# EAGLE design open-race-scale-pi-zero-board-v.04 (EAGLE 8.2.2)
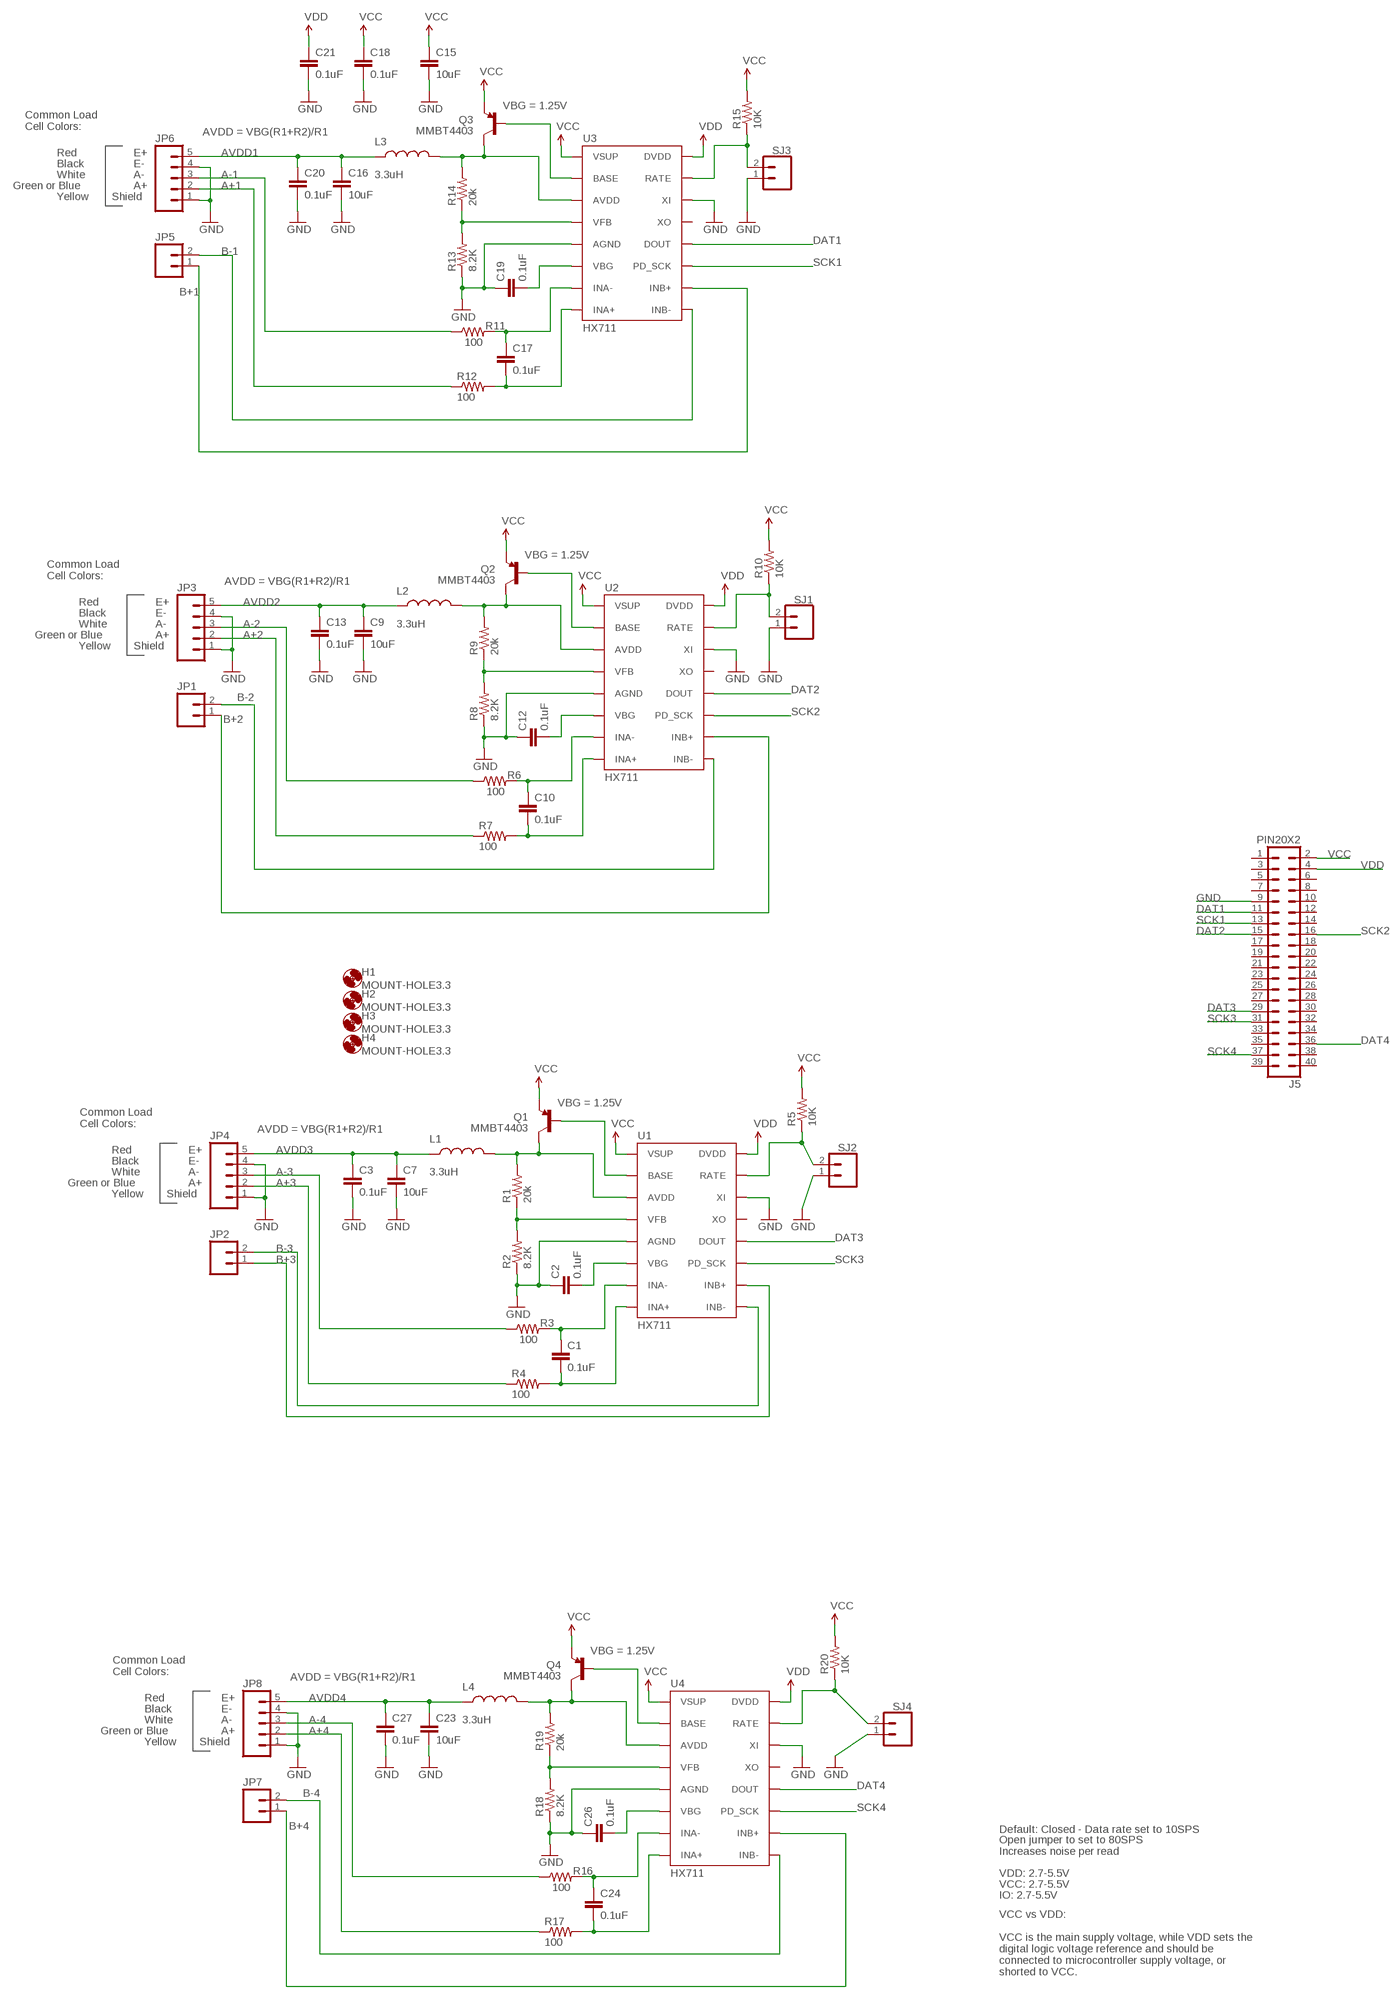
[diagram p0: schematic, sheet 1]

## Parts
C1  0.1uF  0.1UF-25V-5%(0603)  [0603-CAP]
C2  0.1uF  0.1UF-25V-5%(0603)  [0603-CAP]
C3  0.1uF  0.1UF-25V-5%(0603)  [0603-CAP]
C7  10uF  10UF50V20%(1210)  [1210]
C9  10uF  10UF50V20%(1210)  [1210]
C10  0.1uF  0.1UF-25V-5%(0603)  [0603-CAP]
C12  0.1uF  0.1UF-25V-5%(0603)  [0603-CAP]
C13  0.1uF  0.1UF-25V-5%(0603)  [0603-CAP]
C15  10uF  10UF50V20%(1210)  [1210]
C16  10uF  10UF50V20%(1210)  [1210]
C17  0.1uF  0.1UF-25V-5%(0603)  [0603-CAP]
C18  0.1uF  0.1UF-25V-5%(0603)  [0603-CAP]
C19  0.1uF  0.1UF-25V-5%(0603)  [0603-CAP]
C20  0.1uF  0.1UF-25V-5%(0603)  [0603-CAP]
C21  0.1uF  0.1UF-25V-5%(0603)  [0603-CAP]
C23  10uF  10UF50V20%(1210)  [1210]
C24  0.1uF  0.1UF-25V-5%(0603)  [0603-CAP]
C26  0.1uF  0.1UF-25V-5%(0603)  [0603-CAP]
C27  0.1uF  0.1UF-25V-5%(0603)  [0603-CAP]
H1  MOUNT-HOLE3.3  [3,3]
H2  MOUNT-HOLE3.3  [3,3]
H3  MOUNT-HOLE3.3  [3,3]
H4  MOUNT-HOLE3.3  [3,3]
J5  PIN20X2  [PIN_20X2]
JP1  M02PTH  [1X02@1]
JP2  M02PTH  [1X02@1]
JP3  M05PTH  [1X05]
JP4  M05PTH  [1X05]
JP5  M02PTH  [1X02@1]
JP6  M05PTH  [1X05]
JP7  M02PTH  [1X02@1]
JP8  M05PTH  [1X05]
L1  3.3uH  INDUCTOR0805-IND  [0805]
L2  3.3uH  INDUCTOR0805-IND  [0805]
L3  3.3uH  INDUCTOR0805-IND  [0805]
L4  3.3uH  INDUCTOR0805-IND  [0805]
Q1  MMBT4403  TRANSISTOR_PNPMMBT4403  [SOT23-3]
Q2  MMBT4403  TRANSISTOR_PNPMMBT4403  [SOT23-3]
Q3  MMBT4403  TRANSISTOR_PNPMMBT4403  [SOT23-3]
Q4  MMBT4403  TRANSISTOR_PNPMMBT4403  [SOT23-3]
R1  20k  20KOHM1/10W1%(0603)  [0603-RES]
R2  8.2K  8.2KOHM-1/10W-5%(0603)  [0603-RES]
R3  100  100OHM-1/10W-1%(0603)  [0603-RES]
R4  100  100OHM-1/10W-1%(0603)  [0603-RES]
R5  10K  10KOHM-1/10W-1%(0603)0603  [0603-RES]
R6  100  100OHM-1/10W-1%(0603)  [0603-RES]
R7  100  100OHM-1/10W-1%(0603)  [0603-RES]
R8  8.2K  8.2KOHM-1/10W-5%(0603)  [0603-RES]
R9  20k  20KOHM1/10W1%(0603)  [0603-RES]
R10  10K  10KOHM-1/10W-1%(0603)0603  [0603-RES]
R11  100  100OHM-1/10W-1%(0603)  [0603-RES]
R12  100  100OHM-1/10W-1%(0603)  [0603-RES]
R13  8.2K  8.2KOHM-1/10W-5%(0603)  [0603-RES]
R14  20k  20KOHM1/10W1%(0603)  [0603-RES]
R15  10K  10KOHM-1/10W-1%(0603)0603  [0603-RES]
R16  100  100OHM-1/10W-1%(0603)  [0603-RES]
R17  100  100OHM-1/10W-1%(0603)  [0603-RES]
R18  8.2K  8.2KOHM-1/10W-5%(0603)  [0603-RES]
R19  20k  20KOHM1/10W1%(0603)  [0603-RES]
R20  10K  10KOHM-1/10W-1%(0603)0603  [0603-RES]
SJ1  CONN_02  [1X02]
SJ2  CONN_02  [1X02]
SJ3  CONN_02  [1X02]
SJ4  CONN_02  [1X02]
U1  HX711  HX711HX711  [SO16]
U2  HX711  HX711HX711  [SO16]
U3  HX711  HX711HX711  [SO16]
U4  HX711  HX711HX711  [SO16]

## Nets
A+1: JP6.2 R12.1
A+2: JP3.2 R7.1
A+3: JP4.2 R4.1
A+4: JP8.2 R17.1
A-1: JP6.3 R11.1
A-2: JP3.3 R6.1
A-3: JP4.3 R3.1
A-4: JP8.3 R16.1
AVDD1: C16.1 C20.1 JP6.5 L3.1
AVDD2: C9.1 C13.1 JP3.5 L2.1
AVDD3: C3.1 C7.1 JP4.5 L1.1
AVDD4: C23.1 C27.1 JP8.5 L4.1
B+1: JP5.1 U3.10(INB+)
B+2: JP1.1 U2.10(INB+)
B+3: JP2.1 U1.10(INB+)
B+4: JP7.1 U4.10(INB+)
B-1: JP5.2 U3.9(INB-)
B-2: JP1.2 U2.9(INB-)
B-3: JP2.2 U1.9(INB-)
B-4: JP7.2 U4.9(INB-)
DAT1: J5.11 U3.12(DOUT)
DAT2: J5.15 U2.12(DOUT)
DAT3: J5.29 U1.12(DOUT)
DAT4: J5.36 U4.12(DOUT)
GND: C2.1 C3.2 C7.2 C9.2 C12.1 C13.2 C15.2 C16.2 C18.2 C19.1 C20.2 C21.2 C23.2 C26.1 C27.2 J5.9 JP3.1 JP3.4 JP4.1 JP4.4 JP6.1 JP6.4 JP8.1 JP8.4 R2.1 R8.1 R13.1 R18.1 SJ1.1 SJ2.1 SJ3.1 SJ4.1 U1.5(AGND) U1.14(XI) U2.5(AGND) U2.14(XI) U3.5(AGND) U3.14(XI) U4.5(AGND) U4.14(XI)
N$1: R5.1 SJ2.2 U1.15(RATE)
N$2: C1.1 R3.2 U1.7(INA-)
N$3: C1.2 R4.2 U1.8(INA+)
N$4: Q1.1(B) U1.2(BASE)
N$5: L1.2 Q1.3(C) R1.2 U1.3(AVDD)
N$6: R1.1 R2.2 U1.4(VFB)
N$7: C2.2 U1.6(VBG)
N$9: R8.2 R9.1 U2.4(VFB)
N$10: C12.2 U2.6(VBG)
N$20: C17.1 R11.2 U3.7(INA-)
N$21: C17.2 R12.2 U3.8(INA+)
N$22: Q4.1(B) U4.2(BASE)
N$23: R18.2 R19.1 U4.4(VFB)
N$24: C26.2 U4.6(VBG)
N$25: L4.2 Q4.3(C) R19.2 U4.3(AVDD)
N$26: R20.1 SJ4.2 U4.15(RATE)
N$27: C24.1 R16.2 U4.7(INA-)
N$28: C24.2 R17.2 U4.8(INA+)
N$82: Q2.1(B) U2.2(BASE)
N$112: L2.2 Q2.3(C) R9.2 U2.3(AVDD)
N$122: R10.1 SJ1.2 U2.15(RATE)
N$132: C10.1 R6.2 U2.7(INA-)
N$142: C10.2 R7.2 U2.8(INA+)
N$151: Q3.1(B) U3.2(BASE)
N$161: R13.2 R14.1 U3.4(VFB)
N$171: C19.2 U3.6(VBG)
N$182: L3.2 Q3.3(C) R14.2 U3.3(AVDD)
N$191: R15.1 SJ3.2 U3.15(RATE)
SCK1: J5.13 U3.11(PD_SCK)
SCK2: J5.16 U2.11(PD_SCK)
SCK3: J5.31 U1.11(PD_SCK)
SCK4: J5.37 U4.11(PD_SCK)
VCC: C15.1 C18.1 J5.2 Q1.2(E) Q2.2(E) Q3.2(E) Q4.2(E) R5.2 R10.2 R15.2 R20.2 U1.1(VSUP) U2.1(VSUP) U3.1(VSUP) U4.1(VSUP)
VDD: C21.1 J5.4 U1.16(DVDD) U2.16(DVDD) U3.16(DVDD) U4.16(DVDD)
Unconnected: J5.1 J5.3 J5.5 J5.6 J5.7 J5.8 J5.10 J5.12 J5.14 J5.17 J5.18 J5.19 J5.20 J5.21 J5.22 J5.23 J5.24 J5.25 J5.26 J5.27 J5.28 J5.30 J5.32 J5.33 J5.34 J5.35 J5.38 J5.39 J5.40 U1.13(XO) U2.13(XO) U3.13(XO) U4.13(XO)

## Notes on the sheet
- VBG = 1.25V
- Common Load
  Cell Colors:
- AVDD = VBG(R1+R2)/R1
- Red | E+
- Black | E-
- White | A-
- Green or Blue | A+
- Yellow | Shield
- VBG = 1.25V
- Common Load
  Cell Colors:
- AVDD = VBG(R1+R2)/R1
- Red | E+
- Black | E-
- White | A-
- Green or Blue | A+
- Yellow | Shield
- VBG = 1.25V
- Common Load
  Cell Colors:
- AVDD = VBG(R1+R2)/R1
- Red | E+
- Black | E-
- White | A-
- Green or Blue | A+
- Yellow | Shield
- VBG = 1.25V
- Common Load
  Cell Colors:
- AVDD = VBG(R1+R2)/R1
- Red | E+
- Black | E-
- White | A-
- Green or Blue | A+
- Yellow | Shield
- Default: Closed - Data rate set to 10SPS
- Open jumper to set to 80SPS
  Increases noise per read
- VDD: 2.7-5.5V
- VCC: 2.7-5.5V
- IO: 2.7-5.5V
- VCC vs VDD:
  
  VCC is the main supply voltage, while VDD sets the
  digital logic voltage reference and should be
  connected to microcontroller supply voltage, or
  shorted to VCC.

## Library data of the parts
C1-C3 C10 C12 C13 C17-C21 C24 C26 C27 = SparkFun-Capacitors:0.1UF-25V-5%(0603): CAP-08604; PROD_ID: CAP-08604
C7 C9 C15 C16 C23 = SparkFun-Capacitors:10UF50V20%(1210): CAP-09824; PROD_ID: CAP-09824
H1-H4 = holes:MOUNT-HOLE: MOUNTING HOLE with drill center marker
J5 = FLYFISH:PIN20X2
JP1 JP2 JP5 JP7 = SparkFun-Connectors:M02: Standard 2-pin 0.1" header. Use with - straight break away headers ( PRT-00116) - right angle break away headers (PRT-00553) - swiss pins (PRT-00743) - machine pins (PRT-00117) - female headers (PRT-00115) Molex polarized connector foot print use with: PRT-08233 with associated crimp pins and housings. 2.54_SCREWTERM for use with PRT-10571. 3.5mm Screw Terminal footprints for PRT-08084 5mm Screw Terminal footprints for use with PRT-08432
JP3 JP4 JP6 JP8 = SparkFun-Connectors:M05: Header 5 Standard 5-pin 0.1" header. Use with straight break away headers (SKU : PRT-00116), right angle break away headers (PRT-00553), swiss pins (PRT-00743), machine pins (PRT-00117), and female headers (PRT-00115). Molex polarized connector foot print use with SKU : PRT-08230 with associated crimp pins and housings.
L1-L4 = SparkFun-Passives:INDUCTOR: Inductors Basic Inductor/Choke - 0603 and 1206. Footprints are not proven and vary greatly between part numbers. INDUCTOR POWER 3.3UH 4.0A SMD 0.197" L x 0.197" W x 0.177" H (5.00mm x 5.00mm x 4.50mm); PROD_ID: NDUC-13076
Q1-Q4 = SparkFun-DiscreteSemi:TRANSISTOR_PNP: Generic PNP BJT Double check pinouts against datasheets- not all devices are the same! MMBT3906 - 40V 200mA SOT-23 (TRANS-08052) MMBT4403 - 40V 600mA SOT-23 (TRANS-09245); PROD_ID: TRANS-09245
R1 R9 R14 R19 = SparkFun-Resistors:20KOHM1/10W1%(0603): RES-09383; PROD_ID: RES-09383
R2 R8 R13 R18 = SparkFun-Resistors:8.2KOHM-1/10W-5%(0603): RES-10646; PROD_ID: RES-10646
R3 R4 R6 R7 R11 R12 R16 R17 = SparkFun-Resistors:100OHM-1/10W-1%(0603): RES-07863; PROD_ID: RES-07863
R5 R10 R15 R20 = SparkFun-Resistors:10KOHM-1/10W-1%(0603): RES-00824; PROD_ID: RES-00824
SJ1-SJ4 = SparkFun-Connectors:CONN_02: Multi connection point. Often used as Generic Header-pin footprint for 0.1 inch spaced/style header connections On any of the 0.1 inch spaced packages, you can populate with these: Break Away Headers - Straight <https://www.sparkfun.com/products/116> (PRT-00116) Break Away Male Headers - Right Angle <https://www.sparkfun.com/products/553> (PRT-00553) Female Headers <https://www.sparkfun.com/products/115> (PRT-00115) Break Away Headers - Machine Pin <https://www.sparkfun.com/products/117> (PRT-00117) Break Away Female Headers - Swiss Machine Pin <https://www.sparkfun.com/products/743> (PRT-00743) For SCREWTERMINALS and SPRING TERMINALS visit here: Screw Terimnals on SparkFun.com <https://www.sparkfun.com/search/results?term=Screw+Terminals> (5mm/3.5mm/2.54mm spacing) This device is also useful as a general connection point to wire up your design to another part of your project. Our various solder wires solder well into these plated through hole pads. Hook-Up Wire - Assortment (Stranded, 22 AWG) <https://www.sparkfun.com/products/11375> (PRT-11375) Hook-Up Wire - Assortment (Solid Core, 22 AWG) <https://www.sparkfun.com/products/11367> (PRT-11367) View the entire wire category on our website here <https://www.sparkfun.com/categories/141> Special notes: Molex polarized connector foot print use with: PRT-08233 with associated crimp pins and housings. 2.54_SCREWTERM for use with PRT-10571. 3.5mm Screw Terminal footprints for PRT-08084 5mm Screw Terminal footprints for use with PRT-08432
U1-U4 = Testing:HX711; PROD_ID: IC-12445

## Board
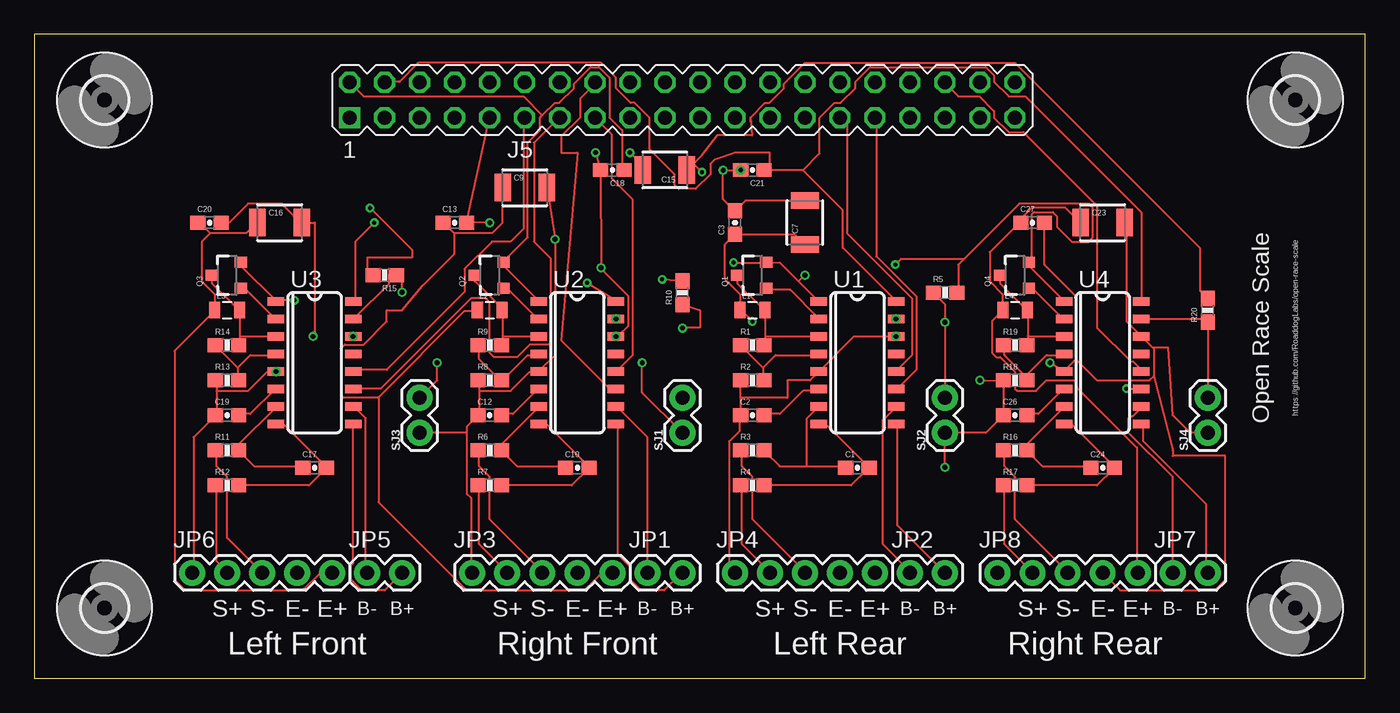
[diagram p1: board, top side]
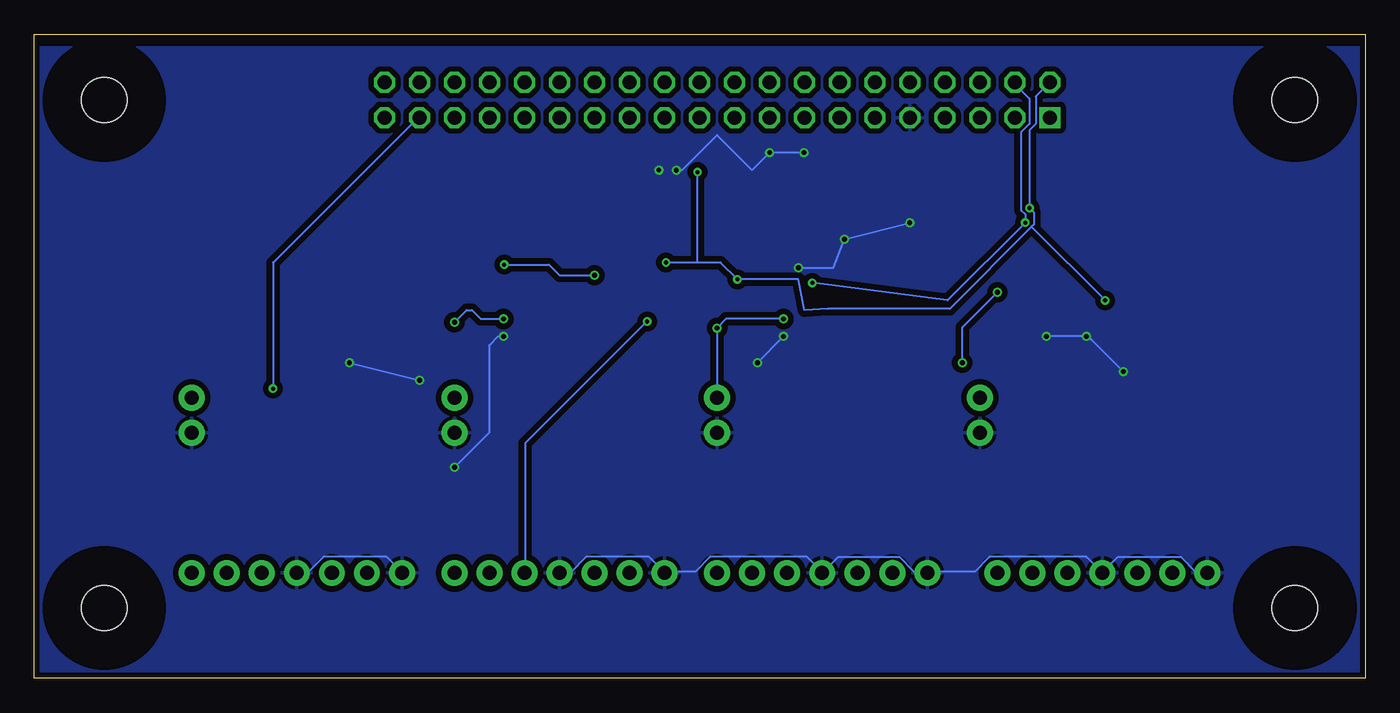
[diagram p2: board, bottom side, seen from below]

Size 96.5 x 46.66 mm. Coordinates in mm from the lower left corner, seen from the top.
Outline: 0,0 96.5,0 96.5,46.66 0,46.66 0,0
Copper layers (1*16): Top 0.035mm / dielectric 1.5mm / Bottom 0.035mm
Design rules "SeeedStudio_2layer_DRU_no_angle_20140221": minimum track width 6mil, minimum drill 12mil, track to track 6mil, track to pad 6mil, pad to pad 6mil, via to via 6mil, smd to smd 0mil, copper to edge 10mil, drill to drill 10mil, minimum pad ring 10mil, minimum via ring 6mil, stop-mask expansion 2mil, vias tented up to drill 100mil, thermal gap 10mil

### Footprints (pad centres in the part's own frame; a part is rotated, then mirrored left to right if it is on the bottom)
0603-CAP = smd 1.1 x 1: 1 -0.85,0; 2 0.85,0
1210 = smd 1.2 x 2: 1 -1.6,0; 2 1.6,0
3,3 = hole 3.3: 0,0
PIN_20X2 = drill 1.016 square: 1 -24.13,-1.27 | drill 1.016 octagon: 2 -24.13,1.27; 3 -21.59,-1.27; 4 -21.59,1.27; 5 -19.05,-1.27; 6 -19.05,1.27; 7 -16.51,-1.27; 8 -16.51,1.27; 9 -13.97,-1.27; 10 -13.97,1.27; 11 -11.43,-1.27; 12 -11.43,1.27; 13 -8.89,-1.27; 14 -8.89,1.27; 15 -6.35,-1.27; 16 -6.35,1.27; 17 -3.81,-1.27; 18 -3.81,1.27; 19 -1.27,-1.27; 20 -1.27,1.27; 21 1.27,-1.27; 22 1.27,1.27; 23 3.81,-1.27; 24 3.81,1.27; 25 6.35,-1.27; 26 6.35,1.27; 27 8.89,-1.27; 28 8.89,1.27; 29 11.43,-1.27; 30 11.43,1.27; 31 13.97,-1.27; 32 13.97,1.27; 33 16.51,-1.27; 34 16.51,1.27; 35 19.05,-1.27; 36 19.05,1.27; 37 21.59,-1.27; 38 21.59,1.27; 39 24.13,-1.27; 40 24.13,1.27
1X02@1 = drill 1.016 pad 1.88: 1 0,0; 2 2.54,0
1X05 = drill 1.016 pad 1.88: 1 0,0; 2 2.54,0; 3 5.08,0; 4 7.62,0; 5 10.16,0
0805 = smd 0.8 x 1.2: 1 -0.9,0; 2 0.9,0
SOT23-3 = smd 0.8 x 0.9: 1 -0.95,-1; 2 0.95,-1; 3 0,1.1
0603-RES = smd 1.1 x 1: 1 -0.85,0; 2 0.85,0
1X02 = drill 1.016 pad 1.88: 1 0,0; 2 2.54,0
SO16 = smd 0.6 x 1.2: 1 -4.445,-2.8; 2 -3.175,-2.8; 3 -1.905,-2.8; 4 -0.635,-2.8; 5 0.635,-2.8; 6 1.905,-2.8; 7 3.175,-2.8; 8 4.445,-2.8; 9 4.445,2.8; 10 3.175,2.8; 11 1.905,2.8; 12 0.635,2.8; 13 -0.635,2.8; 14 -1.905,2.8; 15 -3.175,2.8; 16 -4.445,2.8

### Placement (x,y rotation side)
C1  59.69,15.24 0 top
C2  52.07,19.05 0 top
C3  50.8,33.02 90 top
C7  55.88,33.02 90 top
C9  35.56,35.56 0 top
C10  39.37,15.24 0 top
C12  33.02,19.05 0 top
C13  30.48,33.02 0 top
C15  45.72,36.83 180 top
C16  17.78,33.02 0 top
C17  20.32,15.24 0 top
C18  41.91,36.83 180 top
C19  13.97,19.05 0 top
C20  12.7,33.02 0 top
C21  52.07,36.83 180 top
C23  77.47,33.02 0 top
C24  77.47,15.24 0 top
C26  71.12,19.05 0 top
C27  72.39,33.02 0 top
H1  5.08,5.08 0 top
H2  5.08,41.91 0 top
H3  91.44,41.91 0 top
H4  91.44,5.08 0 top
J5  46.99,41.91 0 top
JP1  44.45,7.62 0 top
JP2  63.5,7.62 0 top
JP3  31.75,7.62 0 top
JP4  50.8,7.62 0 top
JP5  24.13,7.62 0 top
JP6  11.43,7.62 0 top
JP7  82.55,7.62 0 top
JP8  69.85,7.62 0 top
L1  52.07,26.67 0 top
L2  33.02,26.67 0 top
L3  13.97,26.67 0 top
L4  71.12,26.67 0 top
Q1  52.07,29.21 90 top
Q2  33.02,29.21 90 top
Q3  13.97,29.21 90 top
Q4  71.12,29.21 90 top
R1  52.07,24.13 0 top
R2  52.07,21.59 0 top
R3  52.07,16.51 0 top
R4  52.07,13.97 0 top
R5  66.04,27.94 0 top
R6  33.02,16.51 0 top
R7  33.02,13.97 0 top
R8  33.02,21.59 0 top
R9  33.02,24.13 0 top
R10  46.99,27.94 90 top
R11  13.97,16.51 0 top
R12  13.97,13.97 0 top
R13  13.97,21.59 0 top
R14  13.97,24.13 0 top
R15  25.4,29.21 180 top
R16  71.12,16.51 0 top
R17  71.12,13.97 0 top
R18  71.12,21.59 0 top
R19  71.12,24.13 0 top
R20  85.09,26.67 90 top
SJ1  46.99,17.78 90 top
SJ2  66.04,17.78 90 top
SJ3  27.94,17.78 90 top
SJ4  85.09,17.78 90 top
U1  59.69,22.86 270 top
U2  39.37,22.86 270 top
U3  20.32,22.86 270 top
U4  77.47,22.86 270 top

### Tracks (layer width: path | path; a pad name or v marks a point on that pad's centre or on a via)
A+1
  Top 0.152: R12.1 13.21,13.97 13.21,8.48 13.97,7.72 JP6.2
A+2
  Top 0.152: R7.1 32.26,13.97 32.26,9.7 34.24,7.72 JP3.2
A+3
  Top 0.152: R4.1 51.31,13.97 51.31,9.7 53.29,7.72 JP4.2
A+4
  Top 0.152: R17.1 70.36,13.97 70.36,9.7 72.34,7.72 JP8.2
A-1
  Top 0.152: JP6.3 13.97,10.16 13.97,14.58 13.21,15.34 13.21,16.41 R11.1
A-2
  Top 0.152: R6.1 32.26,16.41 32.26,15.34 33.02,14.58 33.02,11.53 36.83,7.72 JP3.3
A-3
  Top 0.152: R3.1 51.31,16.41 51.31,15.34 52.07,14.58 52.07,11.53 55.88,7.72 JP4.3
A-4
  Top 0.152: R16.1 70.36,16.41 70.36,15.34 71.12,14.58 71.12,11.53 74.93,7.72 JP8.3
AVDD1
  Top 0.152: 12.75,32.26 11.99,33.02 C20.1 | 12.75,32.26 15.34,32.26 16.1,33.02 C16.1 | 12.75,32.26 12.14,31.65 12.14,28.75 13.06,27.84 13.06,26.77 L3.1 13.06,26.62 10.16,23.72 10.16,7.11 10.92,6.35 19.46,6.35 20.68,7.57 21.59,7.57 JP6.5
AVDD2
  Top 0.152: 30.43,32.26 29.67,33.02 C13.1 | 30.43,32.26 33.17,32.26 33.93,33.02 C9.1 | 24.94,20.37 31.19,26.62 32.11,26.62 L2.1 | 24.94,20.37 22.35,20.37 22.2,20.52 22.2,23.88 22.5,24.18 23.88,24.18 25.55,25.86 25.55,26.67 26.67,26.67 28.14,28.45 30.43,30.73 30.43,32.26 | 24.94,20.37 24.94,12.75 31.34,6.35 39.88,6.35 41.1,7.57 41.86,7.57 JP3.5
AVDD3  (via drill 0.3)
  Top 0.152: v52.07,25.86 51.31,26.62 L1.1 51.16,26.77 51.16,27.84 50.09,28.91 50.09,31.46 C3.1 55.13,32.17 C7.1
  Bottom 0.152: v52.07,25.86 60.91,17.02 60.91,7.72 JP4.5
AVDD4
  Top 0.152: C23.1 75.84,33.02 74.78,34.09 72.34,34.09 71.58,33.32 71.58,33.02 C27.1 71.42,33.02 69.29,30.89 69.29,28.75 70.21,27.84 70.21,26.77 L4.1 70.21,26.62 69.44,25.86 69.44,23.57 69.75,23.27 70.05,23.27 71.12,22.2 71.12,20.98 71.27,20.83 72.64,20.83 73.41,21.59 75.39,21.59 75.54,21.44 75.54,21.13 79.96,16.71 79.96,7.72 JP8.5
B+1
  Top 0.152: U3.10 23.27,19.61 24.03,18.85 24.03,7.72 JP5.1
B+2
  Top 0.152: JP1.1 44.45,17.48 42.32,19.61 U2.10
B+3
  Top 0.152: U1.10 62.43,19.61 61.52,18.69 61.52,9.7 63.5,7.72 JP2.1
B+4
  Top 0.152: JP7.1 82.55,14.58 79.35,17.78 79.35,18.85 79.5,19 79.65,19 80.26,19.61 U4.10
B-1
  Top 0.152: JP5.2 25.4,6.35 23.72,6.35 22.96,7.11 22.96,8.18 23.11,8.33 23.11,18.39 U3.9
B-2
  Top 0.152: U2.9 42.32,18.39 42.32,8.94 43.23,8.03 43.23,7.11 43.99,6.35 45.67,6.35 46.89,7.57 JP1.2
B-3
  Top 0.152: JP2.2 62.59,11.07 62.59,18.39 U1.9
B-4
  Top 0.152: U4.9 80.42,18.39 80.42,17.17 84.99,12.6 84.99,7.72 JP7.2
DAT1
  Top 0.152: U3.12 23.27,22.35 25.55,22.35 31.19,27.99 31.19,29.67 33.17,31.65 34.54,31.65 35.46,32.56 35.46,40.64 J5.11
DAT2
  Top 0.152: J5.15 41.86,39.42 41.86,36.22 43.38,34.7 43.38,23.42 42.32,22.35 U2.12
DAT3
  Top 0.152: U1.12 62.59,22.35 63.65,23.42 63.65,27.53 58.93,32.26 58.93,40.18 58.47,40.64 J5.29
DAT4
  Top 0.152: U4.12 80.26,22.35 79.65,22.96 79.5,22.96 77.06,25.4 77.06,34.24 71.73,39.57 70.66,39.57 69.6,40.64 69.6,41.1 68.53,42.16 67,42.16 66.09,43.08 J5.36
GND  (via drill 0.35)
  Top 0.152: C23.2 79.2,33.02 79.2,25.86 80.26,24.79 U4.14 80.42,24.64 81.1,23.95 | 75.54,23.11 75.54,27.69 73.25,29.97 73.25,33.02 C27.2 | 81.1,23.95 81.18,23.88 81.18,21.9 | 81.18,21.9 80.87,21.59 77.06,21.59 75.54,23.11 | 70.36,19.15 C26.1 | JP8.4 78.74,6.35 85.6,6.35 86.36,7.11 86.36,16.1 82.55,16.1 82.55,16.51 81.18,21.9 | JP4.1 50.39,8.03 50.39,17.17 51.16,17.93 51.16,19 C2.1 51.22,20.34 | 32.26,20.83 32.26,21.59 R8.1 | 32.26,20.83 32.26,19.15 C12.1 32.11,19 31.34,18.24 31.34,17.78 | 32.26,20.83 34.54,20.83 35.92,22.2 36.52,22.2 U2.5 36.68,22.35 37.74,23.42 v37.74,31.82 37.74,31.85 | 31.34,17.78 31.34,13.36 31.65,13.06 31.65,7.72 JP3.1 | 69.75,7.72 JP8.1 | 41.1,36.83 C18.2 | C20.2 14.12,33.02 15.49,34.39 17.93,34.39 19.3,33.02 C16.2 20.32,33.02 20.32,24.77 v20.2,24.77 | 13.21,20.83 13.21,21.59 R13.1 | 13.21,20.83 13.21,19.15 C19.1 13.06,19 11.53,17.48 11.53,7.72 JP6.1 | 13.21,20.83 15.49,20.83 16.87,22.2 17.48,22.2 U3.5 | 81.1,23.95 82.22,23.95 82.55,19.05 83.82,17.78 SJ4.1 | v42.17,24.77 42.29,24.77 43.08,25.55 43.08,27.69 41.1,29.67 v41.1,29.74 C18.2 | 37.74,31.85 | C7.2 51.55,34.62 C3.2 49.95,34.72 v49.95,36.83 C21.2 | 51.22,20.34 R2.1 | C15.2 44.12,37.16 v43.18,38.1 | v40.68,38.1 C18.2 | C26.1 69,17.78 SJ2.1 v66.04,15.29 66.04,15.24 | 51.22,20.34 54.59,20.34 54.61,20.32 54.61,21.59 56.26,21.59 U1.5 59.43,24.77 v62.49,24.77 | SJ1.1 44.08,20.7 v44.08,22.86 | 31.34,17.78 SJ3.1 | 75.54,23.11 74.78,22.35 U4.5 v73.66,22.86 | 70.27,21.55 C26.1 | 70.27,21.55 R18.1 | v68.58,21.59 70.27,21.55 | 31.34,33.05 J5.9 | 31.34,33.05 C13.2 | C9.2 37.74,31.85 | v33.02,33.02 31.34,33.05
  Bottom 0.152: JP8.4 77.37,7.72 76.61,7.72 75.54,8.79 70.97,8.79 69.9,7.72 JP8.1 | JP4.4 58.32,7.72 57.56,7.72 56.49,8.79 51.92,8.79 50.85,7.72 JP4.1 50.7,7.72 48.57,7.72 47.5,8.79 40.49,8.79 39.42,7.72 JP3.4 38.2,8.79 33.78,8.79 32.71,7.72 31.8,7.72 JP3.1 31.65,7.72 28.3,7.72 27.23,8.79 20.22,8.79 JP6.4 19,7.72 17.93,8.79 13.36,8.79 12.29,7.72 11.53,7.72 JP6.1 | 62.62,24.89 v62.49,24.77 62.87,24.77 63.5,24.13 63.5,17.83 v66.04,15.29 | v41.1,29.74 38.56,29.74 37.82,31.64 v37.74,31.82 v33.02,33.02 | v44.08,22.86 v42.17,24.77 | 40.64,38.1 v40.68,38.1 v43.18,38.1 44.45,36.83 46.99,39.37 49.53,36.83 v49.95,36.83 | v73.66,22.86 v68.58,21.59 | v23.12,24.77 v20.2,24.77 20.02,24.58 19.87,24.58 U3.5
  other vias: 51.22,36.83 17.52,22.23
  pour Bottom (isolate 0.406): 0,45.72 96.52,45.72 96.52,0 0,0
N$1  (via drill 0.35)
  Top 0.152: SJ2.2 v66.04,25.8 66.04,27.09 R5.1 | U1.15 62.5,26.02
  Bottom 0.152: v66.04,25.8 65.17,26.67 64.77,26.67 64.13,26.04 U1.15
  other vias: 62.49,26.04
N$2
  Top 0.152: 56.03,15.34 54.05,15.34 52.98,16.41 R3.2 | 56.03,15.34 58.78,15.34 C1.1 | 56.03,15.34 56.03,18.85 56.79,19.61 U1.7
N$3
  Top 0.152: R4.2 59.23,13.97 60.45,15.19 C1.2 60.45,15.34 57.4,18.39 56.95,18.39 U1.8
N$4
  Top 0.152: Q1.1 53.14,28.14 54.81,28.14 56.79,26.16 U1.2
N$5
  Top 0.152: Q1.3 51,29.21 51,28.6 52.83,26.77 L1.2 52.98,26.62 52.98,24.79 | 52.98,24.79 52.98,24.18 R1.2 | 52.98,24.79 56.79,24.79 U1.3
N$6
  Top 0.152: 52.83,22.5 52.83,21.59 R2.2 | 52.83,22.5 51.31,24.03 R1.1 | 52.83,22.5 53.75,23.42 56.79,23.42 U1.4
N$7
  Top 0.152: C2.2 52.98,19.15 54.05,19.15 55.73,20.83 56.79,20.83 U1.6
N$9
  Top 0.152: R9.1 32.26,24.03 32.26,23.11 33.78,21.59 R8.2 33.93,21.59 35.76,23.42 36.52,23.42 U2.4
N$10
  Top 0.152: C12.2 33.93,19.15 34.7,19.15 36.52,20.98 U2.6
N$20
  Top 0.152: C17.1 19.46,15.34 15.95,15.34 14.88,16.41 R11.2 14.88,16.56 14.88,17.02 17.48,19.61 U3.7
N$21
  Top 0.152: R12.2 19.91,13.97 21.13,15.19 C17.2 21.13,15.34 18.09,18.39 17.63,18.39 U3.8
N$22
  Top 0.152: Q4.1 72.19,28.14 72.49,28.14 74.62,26.01 U4.2
N$23
  Top 0.152: 71.88,21.9 70.36,23.42 70.36,24.03 R19.1 | 71.88,21.9 71.88,21.59 R18.2 71.88,21.9 | 71.88,21.9 73.41,23.42 74.62,23.42 U4.4
N$24
  Top 0.152: C26.2 72.03,19.15 72.8,19.15 74.62,20.98 U4.6
N$25
  Top 0.152: Q4.3 70.05,29.21 70.05,28.6 71.88,26.77 L4.2 72.03,26.62 72.03,24.79 | 72.03,24.79 72.03,24.18 R19.2 | 72.03,24.79 74.62,24.79 U4.3
N$26
  Top 0.152: 80.42,26.16 U4.15 84.88,26.04 R20.1 SJ4.2
N$27
  Top 0.152: C24.1 76.61,15.34 73.1,15.34 72.03,16.41 R16.2 72.03,16.56 72.03,17.02 74.62,19.61 U4.7
N$28
  Top 0.152: R17.2 77.06,13.97 78.28,15.19 C24.2 78.28,15.34 75.23,18.39 74.78,18.39 U4.8
N$82
  Top 0.152: Q2.1 34.09,28.14 34.39,28.14 36.52,26.01 U2.2
N$112
  Top 0.152: Q2.3 31.95,29.21 31.95,28.75 33.93,26.77 L2.2 33.93,26.62 33.93,24.79 | 33.93,24.79 33.93,24.18 R9.2 | 33.93,24.79 36.52,24.79 U2.3
N$122  (via drill 0.35)
  Top 0.152: R10.1 48.26,26.67 48.26,25.4 46.99,25.4 v46.99,25.38
  Bottom 0.152: U2.15 46.36,26.04 v46.99,25.38 SJ1.2
  other vias: 42.17,26.04
N$132
  Top 0.152: C10.1 38.51,15.34 35,15.34 33.93,16.41 R6.2 33.93,16.56 33.93,17.02 36.52,19.61 U2.7
N$142
  Top 0.152: R7.2 38.96,13.97 40.18,15.19 C10.2 40.18,15.34 37.13,18.39 36.68,18.39 U2.8
N$151
  Top 0.152: Q3.1 15.04,28.14 15.34,28.14 17.48,26.01 U3.2
N$161
  Top 0.152: 14.73,22.5 14.73,21.59 R13.2 | 14.73,22.5 13.21,24.03 R14.1 | 14.73,22.5 15.65,23.42 17.48,23.42 U3.4
N$171
  Top 0.152: C19.2 14.88,19.15 15.65,19.15 17.48,20.98 U3.6
N$182
  Top 0.152: Q3.3 12.9,29.21 12.9,28.6 14.73,26.77 L3.2 14.88,26.62 14.88,24.79 | 14.88,24.79 14.88,24.18 R14.2 | 14.88,24.79 17.48,24.79 U3.3
N$191  (via drill 0.35)
  Top 0.152: U3.15 23.27,26.16 25.7,28.6 25.7,29.21 R15.1 26.67,28.79 v26.67,27.97 26.67,27.94 | SJ3.2 29.21,21.59 v29.21,22.86
  Bottom 0.152: v26.67,27.97 29.21,25.43 v29.21,22.86
SCK1
  Top 0.152: U3.11 23.27,20.98 25.09,20.98 31.65,27.53 32.71,27.53 33.02,27.23 33.02,23.57 33.33,23.27 35,23.27 35.92,24.18 37.29,24.18 37.44,24.33 37.44,30.43 36.22,31.65 36.22,38.81 38.05,40.64 J5.13
SCK2
  Top 0.152: U2.11 42.16,20.98 41.71,20.98 38.2,24.49 39.37,38.1 38.2,38.1 38.2,39.27 39.57,40.64 39.57,42.01 40.64,43.08 J5.16
SCK3
  Top 0.152: U1.11 62.59,20.98 63.96,22.35 63.96,27.69 61.06,30.58 61.06,40.64 J5.31
SCK4  (via drill 0.3)
  Top 0.152: v79.2,20.98 80.26,20.98 U4.11
  Bottom 0.152: v79.2,20.98 79.2,30.12 68.68,40.64 J5.37
VCC  (via drill 0.3, 0.35)
  Top 0.152: 51.92,40.64 52.98,41.71 53.29,41.71 54.36,42.77 54.36,43.08 55.88,44.6 71.12,44.6 84.53,31.19 84.53,28.08 R20.2 | 51.92,40.34 51.92,40.64 | 47.8,37.29 47.35,36.83 C15.1 47.8,37.29 | 47.8,37.29 48.41,37.9 49.53,39.37 52.04,39.37 | U2.1 36.52,27.38 34.09,29.82 34.09,30.12 Q2.2 34.09,30.28 35.76,31.95 35.76,38.81 36.68,39.73 36.68,40.64 36.83,40.79 | 36.83,40.79 37.74,41.71 38.05,41.71 39.12,42.77 39.12,43.08 40.34,44.3 40.95,44.3 41.71,43.54 41.71,40.64 42.62,39.73 42.62,36.83 C18.1 | U4.1 74.62,27.38 72.19,29.82 72.19,30.12 Q4.2 72.19,30.28 72.34,30.43 72.34,33.63 72.49,33.78 73.86,33.78 74.17,33.48 74.17,32.71 75.23,31.65 76.45,31.65 76.76,31.95 76.76,34.09 76.45,34.39 71.42,34.39 67.41,30.38 | 67.41,30.38 67,29.97 67,28.05 R5.2 | 55.42,28.75 54.05,30.12 Q1.2 | 55.42,28.75 56.79,27.38 56.81,27.38 U1.1 | 53.14,30.12 Q1.2 | Q3.2 15.04,30.12 15.04,29.82 17.48,27.38 U3.1 17.63,27.38 v18.85,27.38 | v24.33,34.09 27.38,31.04 27.38,30.48 24.13,30.48 24.13,29.21 R15.2 | v50.7,30.12 52.98,30.12 Q1.2 | 36.83,40.79 35.46,42.16 23.88,42.16 J5.2 | v48.41,36.68 47.8,37.29 | v45.52,28.91 45.61,28.91 R10.2 | 67.41,30.38 62.84,30.38 v62.43,29.97 | 52.04,39.37 52.07,39.37 | 51.92,40.64 52.04,39.37 | 55.42,28.75 v55.88,29.21
  Bottom 0.152: J5.2 23.88,42.16 23.88,40.18 24.33,39.73 v24.33,34.09 24.03,33.78 24.03,32.87 24.18,32.71 | 24.18,32.71 30.12,26.77 38.96,26.77 40.64,26.67 41.1,28.91 v45.52,28.91 46.74,30.12 48.41,30.12 | 24.18,32.71 v18.85,27.38 | 48.41,30.12 v50.7,30.12 50.85,29.97 | 48.41,30.12 v48.41,36.68 | v62.43,29.97 59.18,29.97 58.42,29.21 v55.88,29.21
VDD  (via drill 0.3)
  Top 0.152: v24.64,33.02 23.27,31.65 23.27,27.38 U3.16 | U2.16 42.16,27.38 v40.08,28.65 | 55.73,36.83 C21.1 53.34,36.83 53.34,38.1 50.8,38.1 49.33,37.59 49.02,37.29 49.02,36.52 47.95,35.46 46.74,35.46 46.43,35.76 46.43,36.52 44.6,38.35 44.6,40.64 43.54,41.71 43.23,41.71 42.16,42.77 42.16,43.54 41.1,44.6 27.84,44.6 26.47,43.23 25.4,43.23 J5.4 | 55.73,36.83 58.62,33.93 58.62,31.19 62.43,27.38 U1.16 | 55.73,36.83 56.95,38.05 56.95,40.64 58.01,41.71 58.47,41.71 59.54,42.77 59.54,43.23 60.6,44.3 68.99,44.3 69.6,43.69 69.6,43.23 70.66,42.16 71.88,42.16 80.26,33.78 80.26,27.38 U4.16
  Bottom 0.152: J5.4 25.4,43.08 24.33,42.01 24.33,40.18 24.94,39.57 24.94,33.93 24.64,33.63 v24.64,33.02 30.28,27.38 v40.08,28.65

### Text on the board
tPlace: Open Race Scale | https://github.com/RoaddogLabs/open-race-scale | S+ | S- | E- | E+ | B- | B+ | S+ | S- | E- | E+ | B- | B+ | S+ | S- | E- | E+ | B- | B+ | S+ | S- | E- | E+ | B- | B+ | Left Front | Right Front | Left Rear | Right Rear